# EAGLE design mini_keyboard_switchs (EAGLE 9.6.2)
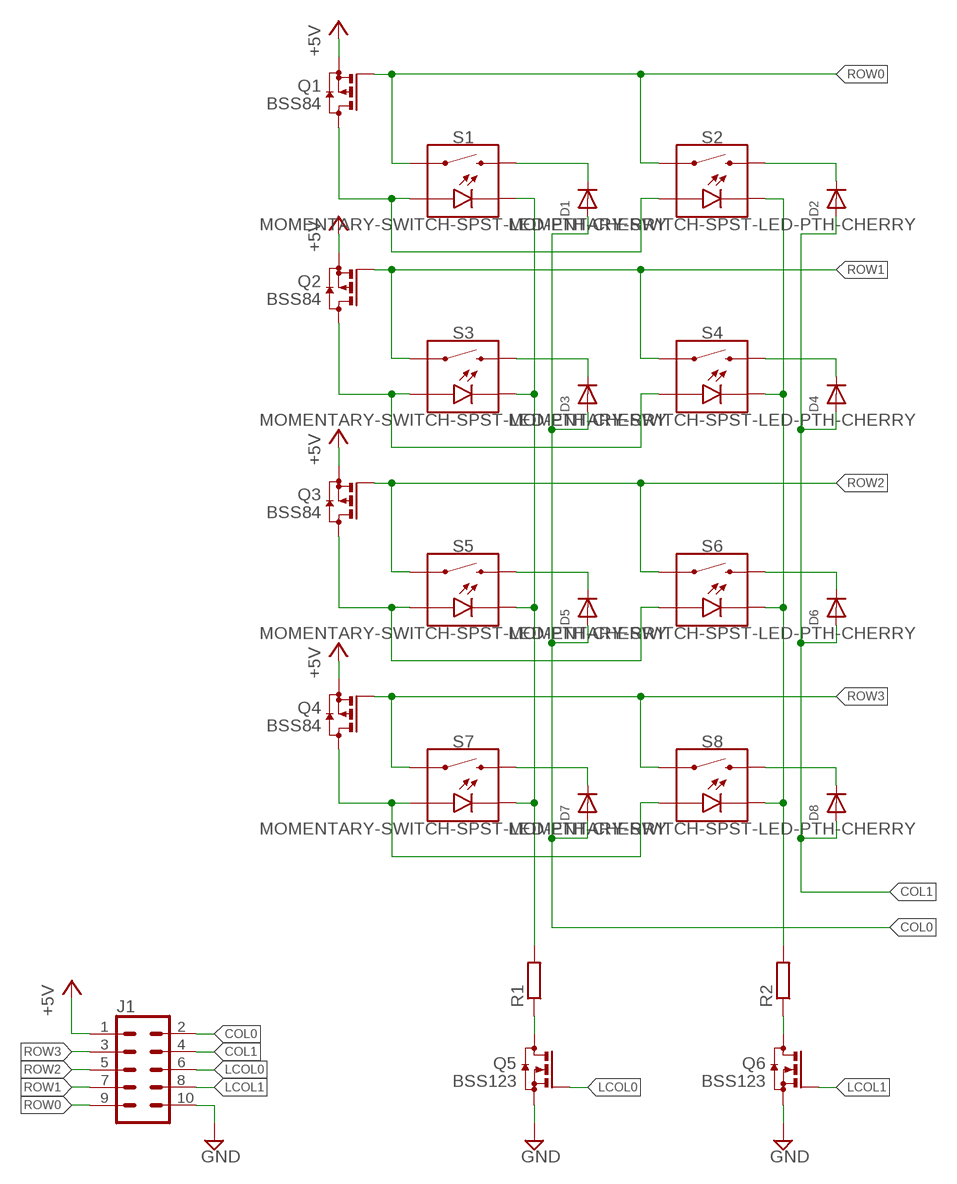
[diagram p0: schematic, sheet 1]

## Parts
D1  DIODESOD-323F  [SOD-323F]
D2  DIODESOD-323F  [SOD-323F]
D3  DIODESOD-323F  [SOD-323F]
D4  DIODESOD-323F  [SOD-323F]
D5  DIODESOD-323F  [SOD-323F]
D6  DIODESOD-323F  [SOD-323F]
D7  DIODESOD-323F  [SOD-323F]
D8  DIODESOD-323F  [SOD-323F]
J1  CONN_05X2PTH  [2X5]
Q1  BSS84  [SOT23]
Q2  BSS84  [SOT23]
Q3  BSS84  [SOT23]
Q4  BSS84  [SOT23]
Q5  BSS123  [SOT23]
Q6  BSS123  [SOT23]
R1  R-EU_R0603  [R0603]
R2  R-EU_R0603  [R0603]
S1  MOMENTARY-SWITCH-SPST-LED-PTH-CHERRY  [CHERRY-MX-LED]
S2  MOMENTARY-SWITCH-SPST-LED-PTH-CHERRY  [CHERRY-MX-LED]
S3  MOMENTARY-SWITCH-SPST-LED-PTH-CHERRY  [CHERRY-MX-LED]
S4  MOMENTARY-SWITCH-SPST-LED-PTH-CHERRY  [CHERRY-MX-LED]
S5  MOMENTARY-SWITCH-SPST-LED-PTH-CHERRY  [CHERRY-MX-LED]
S6  MOMENTARY-SWITCH-SPST-LED-PTH-CHERRY  [CHERRY-MX-LED]
S7  MOMENTARY-SWITCH-SPST-LED-PTH-CHERRY  [CHERRY-MX-LED]
S8  MOMENTARY-SWITCH-SPST-LED-PTH-CHERRY  [CHERRY-MX-LED]

## Nets
+5V: J1.1 Q1.2(S) Q2.2(S) Q3.2(S) Q4.2(S)
COL0: D1.A D3.A D5.A D7.A J1.2
COL1: D2.A D4.A D6.A D8.A J1.4
GND: J1.10 Q5.2(S) Q6.2(S)
LCOL0: J1.6 Q5.1(G)
LCOL1: J1.8 Q6.1(G)
N$1: D7.C S7.S2
N$2: Q4.3(D) S7.A S8.A
N$3: D8.C S8.S2
N$4: D1.C S1.S2
N$5: D3.C S3.S2
N$6: D5.C S5.S2
N$7: D2.C S2.S2
N$8: D4.C S4.S2
N$9: D6.C S6.S2
N$13: Q3.3(D) S5.A S6.A
N$14: Q5.3(D) R1.1
N$15: Q6.3(D) R2.1
N$17: Q2.3(D) S3.A S4.A
N$19: Q1.3(D) S1.A S2.A
N$21: R1.2 S1.K(C) S3.K(C) S5.K(C) S7.K(C)
N$22: R2.2 S2.K(C) S4.K(C) S6.K(C) S8.K(C)
ROW0: J1.9 Q1.1(G) S1.S1 S2.S1
ROW1: J1.7 Q2.1(G) S3.S1 S4.S1
ROW2: J1.5 Q3.1(G) S5.S1 S6.S1
ROW3: J1.3 Q4.1(G) S7.S1 S8.S1

## Library data of the parts
D1-D8 = adafruit:DIODE: Diode SMADIODE - SMA Surface Mount Package 20V 1A Schottky Diode Digikey: 641-1014-6-ND DO-1N4148 - Through Hole Small Current Diode SOD-123 20V 1 A (.5mV Vf) Schottky Diode - Digikey: MBRX120TPMSCT-ND SOD-323 10V 570mA (.38mV Vf, 3ns) Schottky Diode - Digikey: ZLLS410CT-ND SOD-523 30V 30mA Schottky Diode (RB751S-40TE61) - Digikey: RB751S-40TE61CT-ND SOT23-R/W - SOT23 Package (R = Solder Paste/Reflow Ovens, W = Hand-Soldering) BAT54Film 40V 300mA - Digikey: 497-7162-1-ND
J1 = SparkFun-Connectors:CONN_05X2: Multi connection point. Often used as Generic Header-pin footprint for 0.1 inch spaced/style header connections For AVR SPI programming port, see special device with nice symbol: "AVR_SPI_PROG_5x2.dev" You can populate with any combo of single row headers, but if you'd like an exact match, check these: 2x5 AVR ICSP Male Header <https://www.sparkfun.com/products/778> (PRT-00778) 2x5 Pin Shrouded Header <https://www.sparkfun.com/products/8506> (PRT-08506) On any of the 0.1 inch spaced packages, you can populate with these: Break Away Headers - Straight <https://www.sparkfun.com/products/116> (PRT-00116) Break Away Male Headers - Right Angle <https://www.sparkfun.com/products/553> (PRT-00553) Female Headers <https://www.sparkfun.com/products/115> (PRT-00115) Break Away Headers - Machine Pin <https://www.sparkfun.com/products/117> (PRT-00117) Break Away Female Headers - Swiss Machine Pin <https://www.sparkfun.com/products/743> (PRT-00743) Special note: the shrouded connector mates well with our 5x2 ribbon cables: 2x5 Pin IDC Ribbon Cable <https://www.sparkfun.com/products/8535> (PRT-08535); PROD_ID: CONN-08499; SF_ID: PRT-0778
Q1-Q4 = transistor-small-signal:BSS84: P-CHANNEL MOS FET
Q5 Q6 = transistor-small-signal:BSS123: N-CHANNEL MOS FET
R1 R2 = rcl:R-EU_: RESISTOR, European symbol; SPICEPREFIX: R
S1-S8 = SparkFun-Switches:MOMENTARY-SWITCH-SPST-LED: Momentary Switch (Pushbutton) - SPST - w/ LED Normally-open (NO) SPST momentary switches (buttons, pushbuttons), with a built-in LED. Variants PTH-CHERRY - Cherry MX Switch Cherry MX Keyswitches are top-of-the-line mechanical keyboard switches. They’re satisfyingly “clicky”, reliable up to tens-of-millions of key presses, and a standard in gaming and programming keyboards across the globe. This ‘blue’ version Cherry MX Switch is favored by most due to its secondary internal actuator making it less likely to “double-tap.” If you are looking for a noticeably audible and high-quality key switch, this is the perfect option for you! Cherry MX Switch <https://www.sparkfun.com/products/13834> (COM-13834) Cherry MX Switch Breakout <https://www.sparkfun.com/products/13773> (BOB-13773) PTH-12MM and PTH-12MM-KIT - 12mm Illuminated LED KIT variant is for soldering kits. There is no tStop (covering up the top side of the pads with mask). This helps the beginner see which side they should be soldering too. LED Tactile Button Breakout <https://www.sparkfun.com/products/10467> (BOB-10467) LED Tactile Button - Red <https://www.sparkfun.com/products/10442> (COM-10442) LED Tactile Button - Blue <https://www.sparkfun.com/products/10443> (COM-10443) LED Tactile Button - Green <https://www.sparkfun.com/products/10440> (COM-10440) LED Tactile Button - Orange <https://www.sparkfun.com/products/10441> (COM-10441) LED Tactile Button - White <https://www.sparkfun.com/products/10439> (COM-10439); SF_ID: COM-13834

## Board
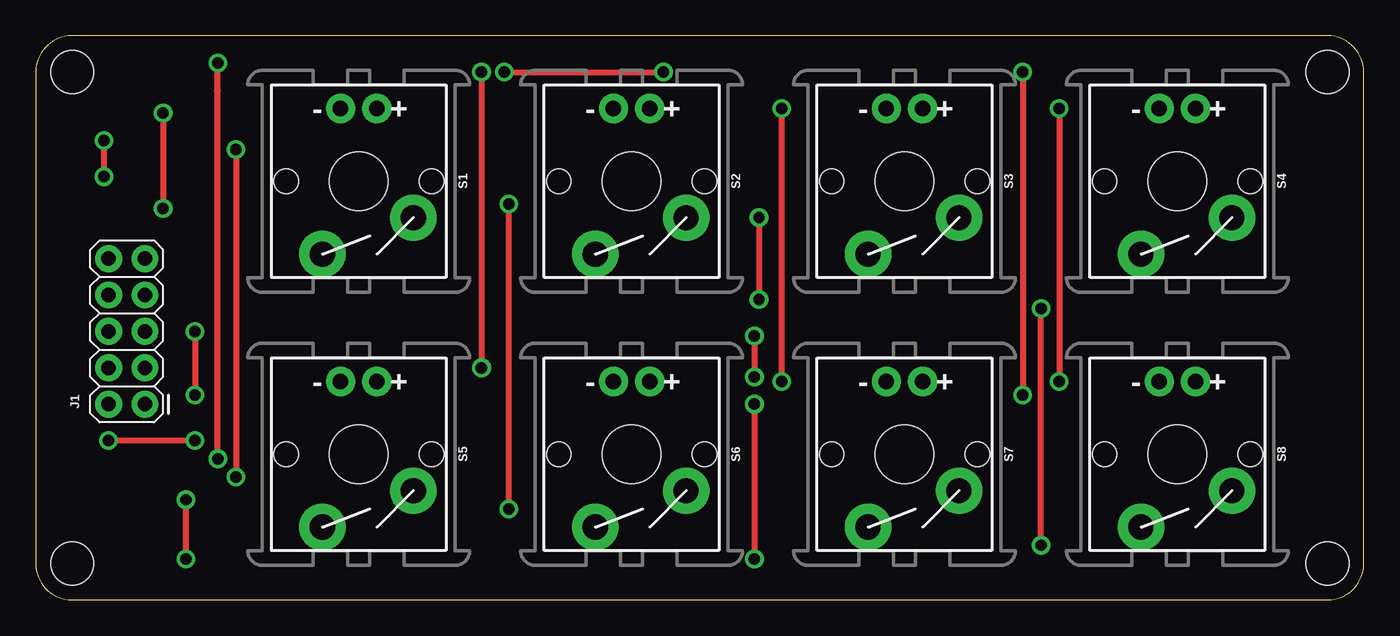
[diagram p1: board, top side]
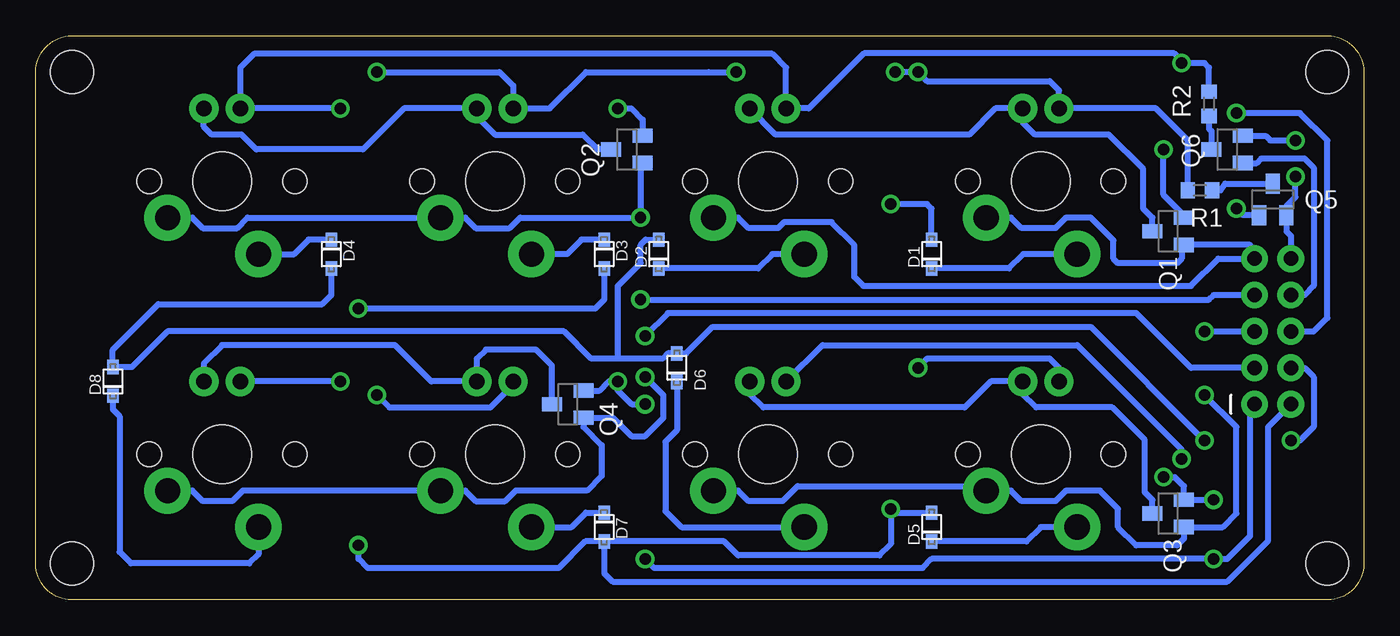
[diagram p2: board, bottom side, seen from below]

Size 92.7 x 39.36 mm. Coordinates in mm from the lower left corner, seen from the top.
Outline: 0,36.86 0,2.5 arc90 2.5,0 90.2,0 arc90 92.7,2.5 92.7,36.86 arc90 90.2,39.36 2.5,39.36 arc90 0,36.86
Copper layers (1*16): Top 0.035mm / dielectric 1.5mm / Bottom 0.035mm
Design rules "default": minimum track width 6mil, minimum drill 0.35mm, track to track 6mil, track to pad 6mil, pad to pad 6mil, via to via 6mil, smd to smd 6mil, copper to edge 40mil, drill to drill 6mil, minimum pad ring 10mil, minimum via ring 8mil, stop-mask expansion 4mil, vias tented up to drill 0mil, thermal gap 10mil
Holes 3 mm at 2.54,36.83 2.54,2.54 90.17,36.83 90.17,2.54

### Footprints (pad centres in the part's own frame; a part is rotated, then mirrored left to right if it is on the bottom)
SOD-323F = smd 1 x 0.8: A -1,0; C 1,0
2X5 = drill 1.016 pad 1.88: 1 0,0; 2 0,2.54; 3 2.54,0; 4 2.54,2.54; 5 5.08,0; 6 5.08,2.54; 7 7.62,0; 8 7.62,2.54; 9 10.16,0; 10 10.16,2.54
SOT23 = smd 1 x 1.4: 1 -0.95,-1.1; 2 0.95,-1.1; 3 0,1.1
R0603 = smd 1 x 1.1: 1 -0.85,0; 2 0.85,0
CHERRY-MX-LED = drill 1.092 pad 2.032: A -1.27,-5.08; K 1.27,-5.08 | drill 1.753 pad 3.226: S1 -3.81,2.54; S2 2.54,5.08 | hole 4.089: 0,0 | hole 1.707: -5.08,0; 5.08,0

### Placement (x,y rotation side)
D1  30.16,24.13 270 bottom
D2  49.21,24.13 270 bottom
D3  53.02,24.13 90 bottom
D4  72.07,24.13 90 bottom
D5  30.16,5.08 270 bottom
D6  47.94,16.19 270 bottom
D7  53.02,5.08 90 bottom
D8  87.31,15.24 270 bottom
J1  7.62,13.65 90 top
Q1  13.65,25.72 90 bottom
Q2  51.44,31.43 90 bottom
Q3  13.65,6.03 90 bottom
Q4  55.56,13.65 90 bottom
Q5  6.35,27.94 0 bottom
Q6  9.53,31.43 90 bottom
R1  11.43,28.57 180 bottom
R2  10.79,34.61 90 bottom
S1  22.54,29.21 180 top
S2  41.59,29.21 180 top
S3  60.64,29.21 180 top
S4  79.69,29.21 180 top
S5  22.54,10.16 180 top
S6  41.59,10.16 180 top
S7  60.64,10.16 180 top
S8  79.69,10.16 180 top

### Tracks (layer width: path | path; a pad name or v marks a point on that pad's centre or on a via)
+5V  (via drill 0.8 pad 1.3)
  Top 0.406: v52.07,34.29 v52.07,15.24 | v13.97,31.43 v13.97,8.57 | v50.16,13.65 v50.16,2.86 | v10.48,6.99 v10.48,2.86
  Bottom 0.406: Q4.2 53.34,14.6 52.7,15.24 v52.07,15.24 52.07,14.61 51.12,13.65 v50.16,13.65 | Q1.2 12.55,26.84 13.97,28.26 v13.97,31.43 | v13.97,8.57 13.19,8.57 12.55,7.93 Q3.2 v10.48,6.98 v10.48,6.99 | J1.1 7.94,13.34 7.94,4.45 9.53,2.86 v10.48,2.86 30.16,2.86 30.8,2.22 49.53,2.22 v50.16,2.86 | Q2.2 50.34,33.51 51.12,34.29 v52.07,34.29
COL0  (via drill 0.8 pad 1.3)
  Top 0.406: v33.02,27.62 v33.02,6.35 | v70.17,3.81 v70.17,20.32
  Bottom 0.406: J1.2 6.67,12.06 6.67,4.13 9.53,1.27 52.44,1.27 53.02,1.86 D7.A | D1.A 30.16,27.3 30.48,27.62 v33.02,27.62 | D5.A 32.75,6.08 v33.02,6.35 33.02,3.88 33.79,3.11 43.68,3.11 44.65,4.08 D7.A | D7.A 54.34,4.08 56.2,2.22 69.53,2.22 70.17,2.86 v70.17,3.81 | D3.A 53.02,20.95 53.66,20.32 v70.17,20.32
COL1  (via drill 0.8 pad 1.3)
  Top 0.406: v11.11,11.11 v5.08,11.11
  Bottom 0.406: 52.07,16.88 53.98,16.88 55.83,18.73 83.5,18.73 86,16.24 D8.A 87.31,17.46 84.14,20.64 72.71,20.64 72.07,21.27 D4.A | 52.07,16.88 48.9,16.88 48.58,17.19 D6.A 47.31,17.19 45.45,19.05 19.05,19.05 v11.11,11.11 | J1.4 4.13,16.19 3.49,15.56 3.49,12.06 4.45,11.11 v5.08,11.11 | D2.A 50.12,25.13 50.48,24.77 50.48,23.5 52.07,21.91 52.07,16.88
GND  (via drill 0.8 pad 1.3)
  Top 0.406: v4.76,29.53 v4.76,32.07
  Bottom 0.406: J1.10 5.08,25.4 5.4,25.72 Q5.2 5.4,27.48 4.76,28.11 v4.76,29.53 | Q6.2 6.84,32.38 6.52,32.07 v4.76,32.07
LCOL0  (via drill 0.8 pad 1.3)
  Top 0.406: v8.89,33.97 v8.89,27.3
  Bottom 0.406: J1.6 3.49,18.73 2.54,19.68 2.54,32.07 4.45,33.97 v8.89,33.97 | Q5.1 8.43,26.84 v8.89,27.3
LCOL1
  Bottom 0.406: Q6.1 7.47,30.48 7.16,30.8 4.13,30.8 3.49,30.16 3.49,21.91 4.13,21.27 J1.8
N$1
  Bottom 0.406: S7.S2 55.29,5.08 54.29,6.08 D7.C
N$2
  Bottom 0.406: S8.A 80.96,16.51 79.69,17.78 67.63,17.78 65.09,15.24 S7.A 61.91,16.83 61.28,17.46 57.78,17.46 56.66,16.34 Q4.3
N$3
  Bottom 0.406: S8.S2 77.15,3.17 77.79,2.54 86.04,2.54 86.84,3.34 86.84,12.82 87.31,13.29 D8.C
N$4
  Bottom 0.406: D1.C 24.77,23.13 23.77,24.13 S1.S2
N$5
  Bottom 0.406: D3.C 54.61,25.13 55.61,24.13 S3.S2
N$6
  Bottom 0.406: S5.S2 22.54,5.08 23.54,4.08 D5.C
N$7
  Bottom 0.406: S2.S2 41.27,24.13 42.27,23.13 D2.C
N$8
  Bottom 0.406: D4.C 73.66,25.13 74.66,24.13 S4.S2
N$9
  Bottom 0.406: S6.S2 47.62,5.08 48.74,6.2 48.74,11.02 47.94,11.82 D6.C
N$13
  Bottom 0.406: S6.A 42.86,14.38 41.91,13.42 27.85,13.42 26.04,15.24 S5.A 23.81,14.38 22.86,13.42 17.55,13.42 15.29,11.17 15.29,7.52 14.75,6.98 Q3.3
N$14
  Bottom 0.406: R1.1 9.99,28.57 9.67,29.04 Q5.3
N$15
  Bottom 0.406: R2.1 10.79,32.87 10.62,32.7 Q6.3
N$17
  Bottom 0.406: S4.A 80.96,33.02 80.42,32.47 78.34,32.47 77.3,31.43 69.85,31.43 66.99,34.29 S3.A 61.91,33.74 60.64,32.47 54.53,32.47 53.49,31.43 Q2.3
N$19
  Bottom 0.406: Q1.3 14.75,26.67 15.39,27.31 15.39,30.07 17.8,32.47 22.95,32.47 23.81,33.34 S1.A 25.72,34.29 27.53,32.47 41.05,32.47 S2.A
N$21  (via drill 0.8 pad 1.3)
  Top 0.406: v68.9,36.83 v68.9,14.29 | v31.11,36.83 v31.11,16.19 | v32.7,36.83 v43.81,36.83
  Bottom 0.406: R1.2 12.28,32.07 14.5,34.29 S1.K 21.27,35.56 21.91,36.2 30.48,36.2 v31.11,36.83 v32.7,36.83 | v68.9,14.29 68.03,13.42 60.96,13.42 59.37,15.01 S7.K | S5.K 21.27,16.19 21.91,16.83 30.48,16.83 v31.11,16.19 | v68.9,36.83 60.33,36.83 59.37,35.88 S3.K 56.83,34.29 54.29,36.83 45.72,36.83 v43.81,36.83
N$22  (via drill 0.8 pad 1.3)
  Top 0.406: v71.44,34.29 v71.44,15.24 | v12.7,37.47 12.7,35.56 12.65,35.51 12.65,9.9 v12.7,9.84
  Bottom 0.406: R2.2 10.79,37.15 11.11,37.47 v12.7,37.47 12.7,37.62 13.22,38.14 34.88,38.14 38.73,34.29 S2.K 40.32,37.15 41.27,38.1 77.47,38.1 78.42,37.15 S4.K v71.44,34.29 | v71.44,15.24 S8.K | S6.K 37.78,17.78 20,17.78 12.7,10.48 v12.7,9.84
ROW0
  Bottom 0.406: S1.S1 24.62,26.67 23.89,25.95 21.51,25.95 20.78,26.67 19.05,26.67 17.46,25.08 17.46,23.81 17.14,23.5 13.02,23.5 12.7,23.81 12.7,24.62 Q1.1 12.7,24.77 7.94,24.77 7.62,24.45 J1.9 10.16,23.81 12.06,21.91 34.92,21.91 35.56,22.54 35.56,24.77 37.15,26.35 40.47,26.35 40.88,25.95 42.94,25.95 43.67,26.67 S2.S1
ROW1  (via drill 0.8 pad 1.3)
  Top 0.406: v50.48,26.67 v50.48,20.95
  Bottom 0.406: v50.48,20.95 10.79,20.95 10.48,21.27 J1.7 | S4.S1 81.77,26.67 81.04,25.95 78.66,25.95 77.93,26.67 S3.S1 62.72,26.67 61.99,25.95 59.61,25.95 58.88,26.67 v50.48,26.67 50.48,30.34 Q2.1
ROW2  (via drill 0.8 pad 1.3)
  Top 0.406: v11.11,18.73 v11.11,14.29
  Bottom 0.406: v11.11,18.73 J1.5 | v11.11,14.29 8.89,12.06 8.89,6.04 9.84,5.08 Q3.1 12.55,4.28 13.02,3.81 15.88,3.81 17.14,5.08 17.14,6.35 18.41,7.62 20.78,7.62 21.51,6.9 23.89,6.9 24.62,7.62 S5.S1 26.67,7.94 39.52,7.94 40.56,6.9 42.94,6.9 43.67,7.62 S6.S1
ROW3  (via drill 0.8 pad 1.3)
  Top 0.406: v50.16,18.41 v50.16,15.56
  Bottom 0.406: v50.16,15.56 48.9,14.29 48.9,12.7 50.16,11.43 51.12,11.43 52.39,12.7 Q4.1 54.46,12.07 53.19,10.8 53.19,8.65 54.22,7.62 59.2,7.62 59.93,6.9 61.99,6.9 62.72,7.62 S7.S1 78.25,7.62 78.98,6.9 81.04,6.9 81.77,7.62 S8.S1 | v50.16,18.41 48.58,20 15.88,20 12.06,16.19 J1.3